# Altium schematic sheet 10-Sensing.SchDoc: Sensing (part 1 of 2)
size A2; DocumentNumber: 10; SheetNumber: 10; SheetTotal: 15
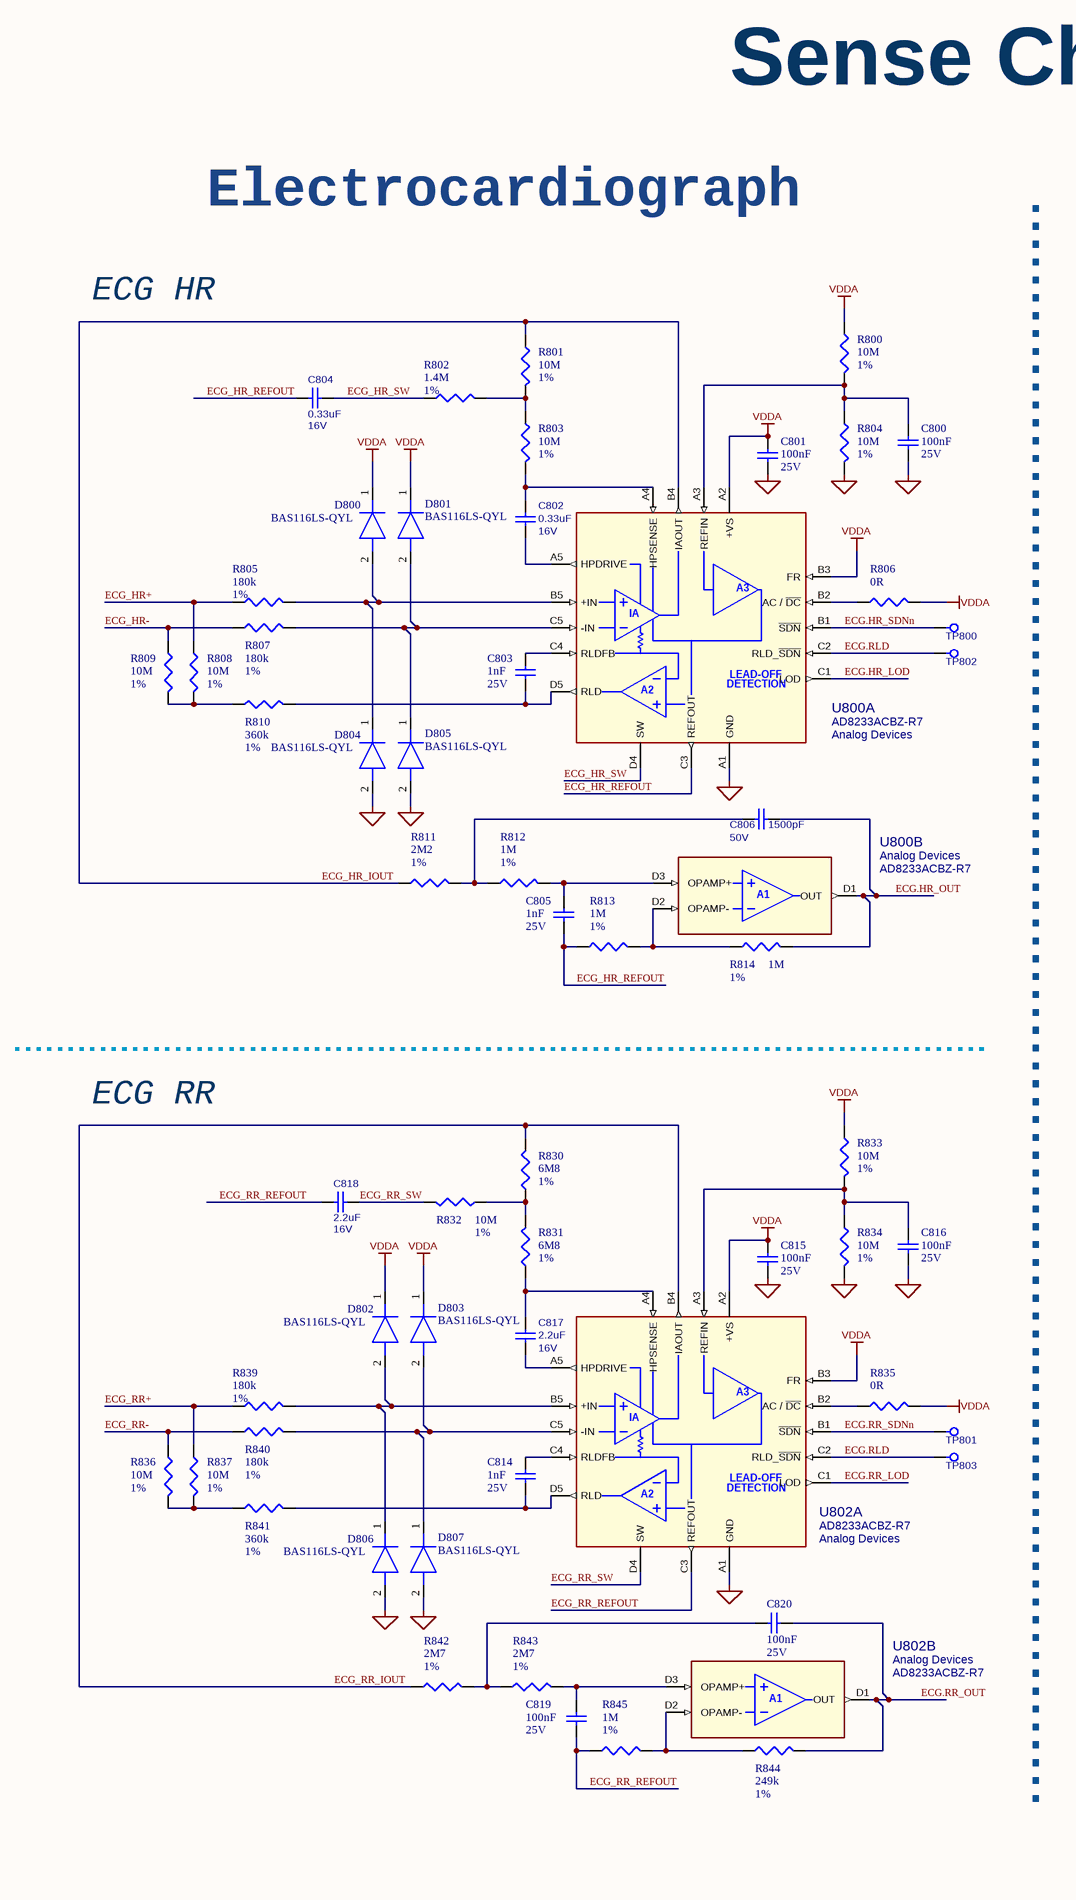
[diagram p0: 10-Sensing.SchDoc, left]
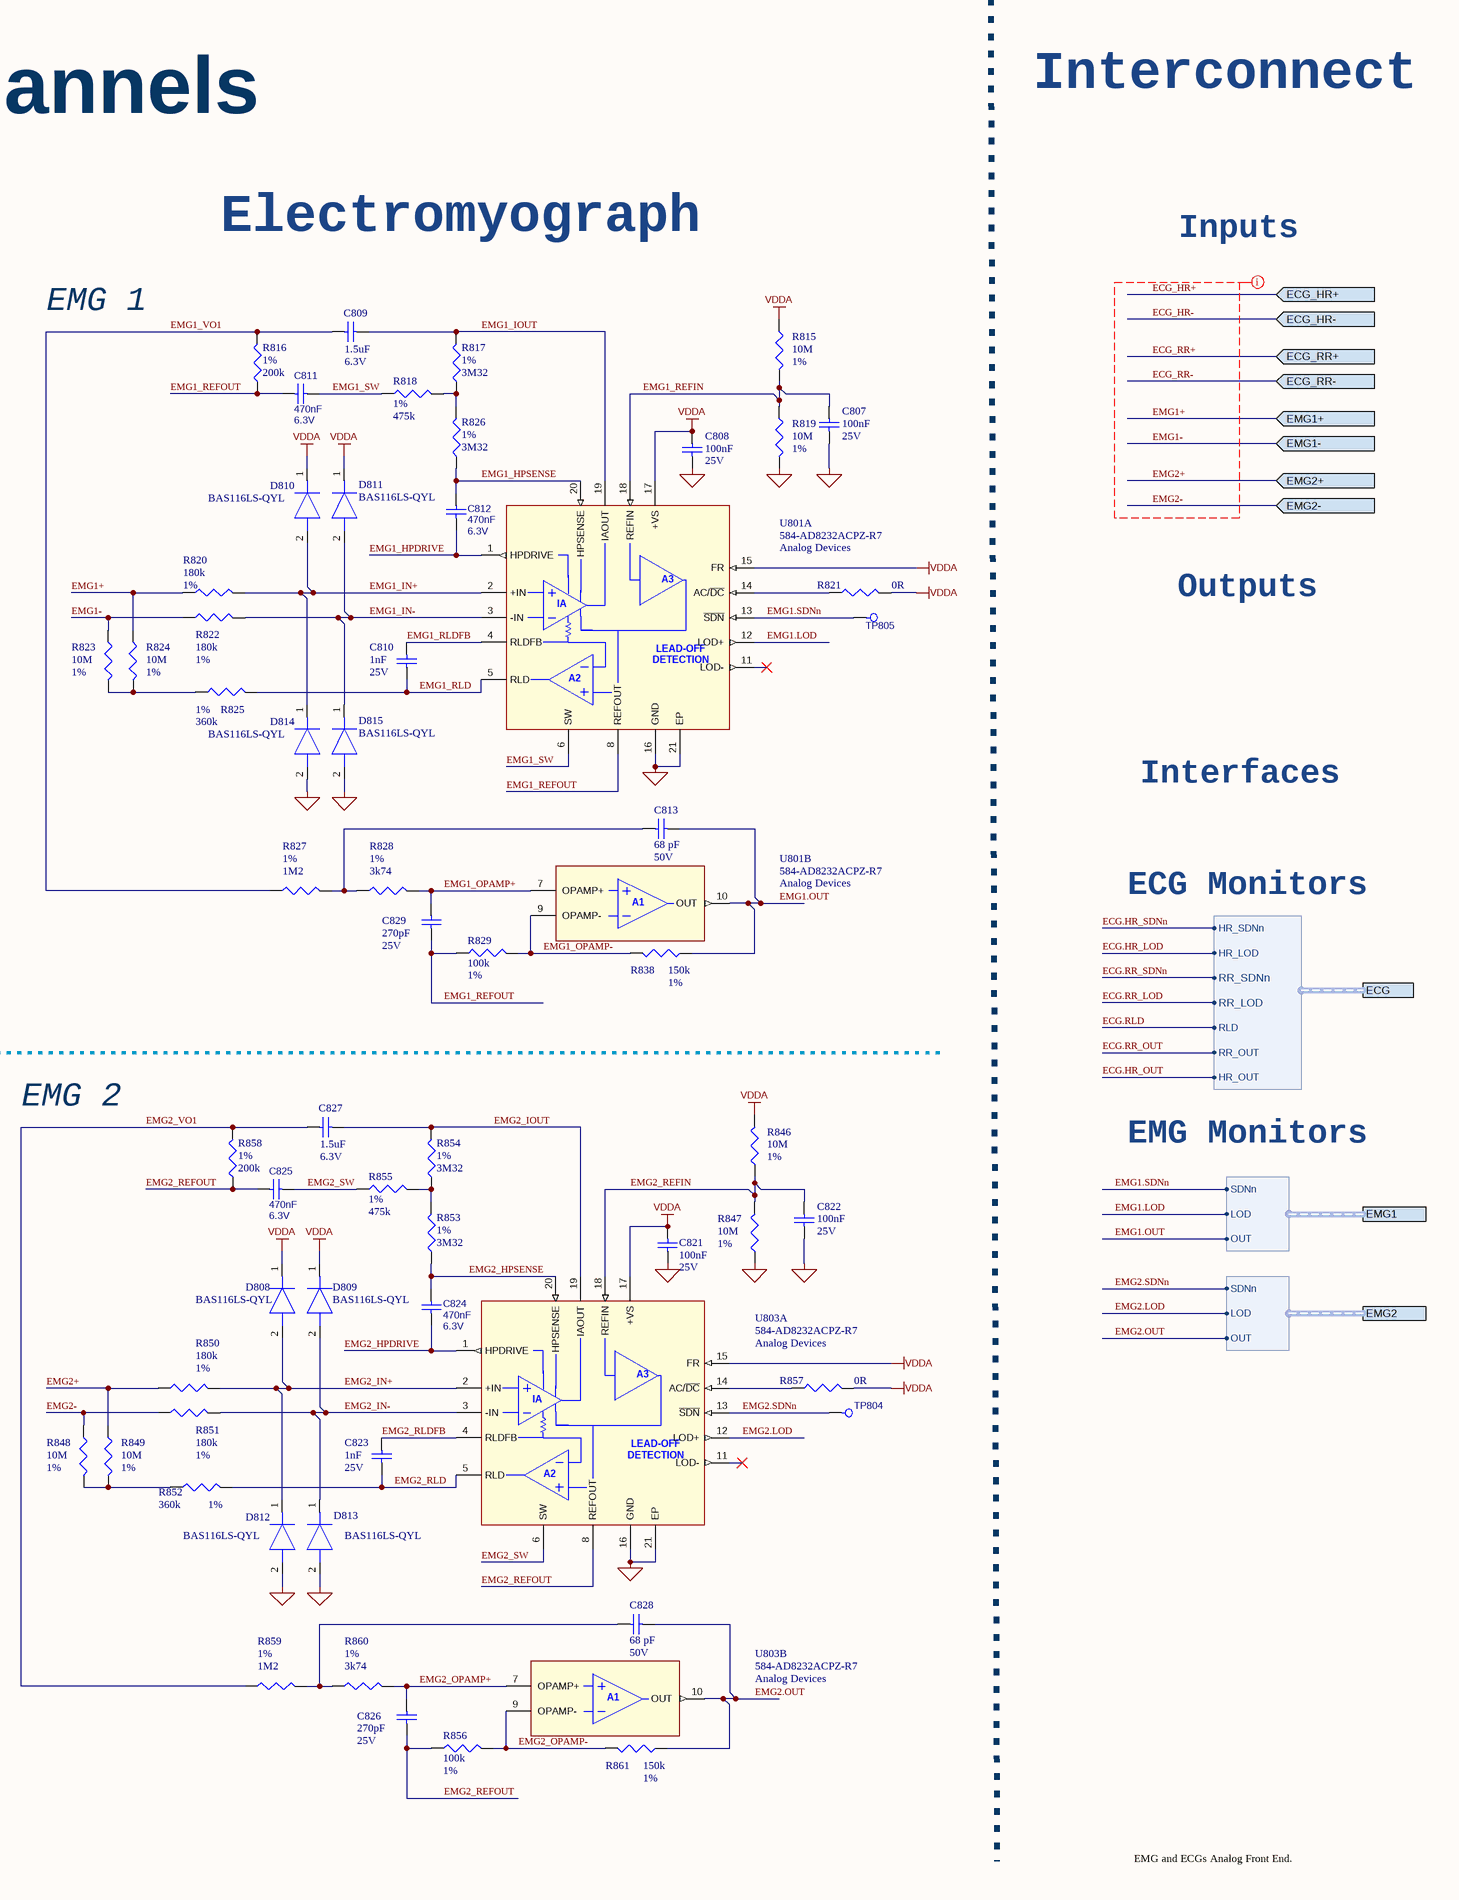
[diagram p1: 10-Sensing.SchDoc, right]

## Parts
C800  value 100nF  Rated DC Voltage (URdc): 25V  [C0201_C]  (hidden comment: GRM033R61E104KE14J)
C801  value 100nF  Rated DC Voltage (URdc): 25V  [C0201_C]  (hidden comment: GRM033R61E104KE14J)
C802  value 0.33uF  Rating: 16V  [CAP0402_REDUCED]  (hidden comment: CGA2B1X7S1C334K050BC)
C803  value 1nF  Rated DC Voltage (URdc): 25V  [C0201_C]  (hidden comment: GRM033R71E102KA01J)
C804  value 0.33uF  Rating: 16V  [CAP0402_REDUCED]  (hidden comment: CGA2B1X7S1C334K050BC)
C805  value 1nF  Rated DC Voltage (URdc): 25V  [C0201_C]  (hidden comment: GRM033R71E102KA01J)
C806  value 1500pF  Rating: 50V  [CAP0402_REDUCED]  (hidden comment: GCM155R71H152KA37D)
C807  value 100nF  Rated DC Voltage (URdc): 25V  [C0201_C]  (hidden comment: GRM033R61E104KE14J)
C808  value 100nF  Rated DC Voltage (URdc): 25V  [C0201_C]  (hidden comment: GRM033R61E104KE14J)
C809  value 1.5uF  Rated DC Voltage (URdc): 6.3V  [C0201_C]  (hidden comment: GRM033R60J155ME14D)
C810  value 1nF  Rated DC Voltage (URdc): 25V  [C0201_C]  (hidden comment: GRM033R71E102KA01J)
C811  value 470nF  Rating: 6.3V  [C0201_C]  (hidden comment: GRT033R60J474KE01D)
C812  value 470nF  Rating: 6.3V  [C0201_C]  (hidden comment: GRT033R60J474KE01D)
C813  value 68 pF  Rated DC Voltage (URdc): 50V  [C0201_C]  (hidden comment: GRM0335C1H680JA01D)
C814  value 1nF  Rated DC Voltage (URdc): 25V  [C0201_C]  (hidden comment: GRM033R71E102KA01J)
C815  value 100nF  Rated DC Voltage (URdc): 25V  [C0201_C]  (hidden comment: GRM033R61E104KE14J)
C816  value 100nF  Rated DC Voltage (URdc): 25V  [C0201_C]  (hidden comment: GRM033R61E104KE14J)
C817  value 2.2uF  Rating: 16V  [CAP0603_REDUCED]  (hidden comment: GRM188Z71C225ME43J)
C818  value 2.2uF  Rating: 16V  [CAP0603_REDUCED]  (hidden comment: GRM188Z71C225ME43J)
C819  value 100nF  Rated DC Voltage (URdc): 25V  [C0201_C]  (hidden comment: GRM033R61E104KE14J)
C820  value 100nF  Rated DC Voltage (URdc): 25V  [C0201_C]  (hidden comment: GRM033R61E104KE14J)
C821  value 100nF  Rated DC Voltage (URdc): 25V  [C0201_C]  (hidden comment: GRM033R61E104KE14J)
C822  value 100nF  Rated DC Voltage (URdc): 25V  [C0201_C]  (hidden comment: GRM033R61E104KE14J)
C823  value 1nF  Rated DC Voltage (URdc): 25V  [C0201_C]  (hidden comment: GRM033R71E102KA01J)
C824  value 470nF  Rating: 6.3V  [C0201_C]  (hidden comment: GRT033R60J474KE01D)
C825  value 470nF  Rating: 6.3V  [C0201_C]  (hidden comment: GRT033R60J474KE01D)
C826  value 270pF  Rated DC Voltage (URdc): 25V  [C0201_C]  (hidden comment: GRM0335C1E271JA01D)
C827  value 1.5uF  Rated DC Voltage (URdc): 6.3V  [C0201_C]  (hidden comment: GRM033R60J155ME14D)
C828  value 68 pF  Rated DC Voltage (URdc): 50V  [C0201_C]  (hidden comment: GRM0335C1H680JA01D)
C829  value 270pF  Rated DC Voltage (URdc): 25V  [C0201_C]  (hidden comment: GRM0335C1E271JA01D)
D800  BAS116LS-QYL  [BAS116LSQYL]
D801  BAS116LS-QYL  [BAS116LSQYL]
D802  BAS116LS-QYL  [BAS116LSQYL]
D803  BAS116LS-QYL  [BAS116LSQYL]
D804  BAS116LS-QYL  [BAS116LSQYL]
D805  BAS116LS-QYL  [BAS116LSQYL]
D806  BAS116LS-QYL  [BAS116LSQYL]
D807  BAS116LS-QYL  [BAS116LSQYL]
D808  BAS116LS-QYL  [BAS116LSQYL]
D809  BAS116LS-QYL  [BAS116LSQYL]
D810  BAS116LS-QYL  [BAS116LSQYL]
D811  BAS116LS-QYL  [BAS116LSQYL]
D812  BAS116LS-QYL  [BAS116LSQYL]
D813  BAS116LS-QYL  [BAS116LSQYL]
D814  BAS116LS-QYL  [BAS116LSQYL]
D815  BAS116LS-QYL  [BAS116LSQYL]
R800  value 10M  Tolerance: 1%  [R0201_C]  (hidden comment: CRCW020110M0FNED)
R801  value 10M  Tolerance: 1%  [R0201_C]  (hidden comment: CRCW020110M0FNED)
R802  value 1.4M  Tolerance: 1%  [R0201_C]  (hidden comment: CRCW02011M40FNED)
R803  value 10M  Tolerance: 1%  [R0201_C]  (hidden comment: CRCW020110M0FNED)
R804  value 10M  Tolerance: 1%  [R0201_C]  (hidden comment: CRCW020110M0FNED)
R805  value 180k  Tolerance: 1%  [R0201_C]  (hidden comment: CRCW0201180KFNED)
R806  value 0R  [R0201_C]  (hidden comment: CRCW02010000Z0ED)
R807  value 180k  Tolerance: 1%  [R0201_C]  (hidden comment: CRCW0201180KFNED)
R808  value 10M  Tolerance: 1%  [R0201_C]  (hidden comment: CRCW020110M0FNED)
R809  value 10M  Tolerance: 1%  [R0201_C]  (hidden comment: CRCW020110M0FNED)
R810  value 360k  Tolerance: 1%  [R0201_C]  (hidden comment: CRCW0201360KFNED)
R811  value 2M2  Tolerance: 1%  [R0201_C]  (hidden comment: CRCW02012M20FNED)
R812  value 1M  Tolerance: 1%  [R0201_C]  (hidden comment: CRCW02011M00FNED)
R813  value 1M  Tolerance: 1%  [R0201_C]  (hidden comment: CRCW02011M00FNED)
R814  value 1M  Tolerance: 1%  [R0201_C]  (hidden comment: CRCW02011M00FNED)
R815  value 10M  Tolerance: 1%  [R0201_C]  (hidden comment: CRCW020110M0FNED)
R816  value 200k  Tolerance: 1%  [R0201_C]  (hidden comment: CRCW0201200KFNED)
R817  value 3M32  Tolerance: 1%  [R0201_C]  (hidden comment: CRCW02013M32FNED)
R818  value 475k  Tolerance: 1%  [R0201_C]  (hidden comment: CRCW0201475KFNED)
R819  value 10M  Tolerance: 1%  [R0201_C]  (hidden comment: CRCW020110M0FNED)
R820  value 180k  Tolerance: 1%  [R0201_C]  (hidden comment: CRCW0201180KFNED)
R821  value 0R  [R0201_C]  (hidden comment: CRCW02010000Z0ED)
R822  value 180k  Tolerance: 1%  [R0201_C]  (hidden comment: CRCW0201180KFNED)
R823  value 10M  Tolerance: 1%  [R0201_C]  (hidden comment: CRCW020110M0FNED)
R824  value 10M  Tolerance: 1%  [R0201_C]  (hidden comment: CRCW020110M0FNED)
R825  value 360k  Tolerance: 1%  [R0201_C]  (hidden comment: CRCW0201360KFNED)
R826  value 3M32  Tolerance: 1%  [R0201_C]  (hidden comment: CRCW02013M32FNED)
R827  value 1M2  Tolerance: 1%  [R0201_C]  (hidden comment: CRCW02011M20FNED)
R828  value 3k74  Tolerance: 1%  [R0201_C]  (hidden comment: CRCW02013K74FNED)
R829  value 100k  Tolerance: 1%  [R0201_C]  (hidden comment: CRCW0201100KFNED)
R830  value 6M8  Tolerance: 1%  [R0201_C]  (hidden comment: CRCW02016M80FNED)
R831  value 6M8  Tolerance: 1%  [R0201_C]  (hidden comment: CRCW02016M80FNED)
R832  value 10M  Tolerance: 1%  [R0201_C]  (hidden comment: CRCW020110M0FNED)
R833  value 10M  Tolerance: 1%  [R0201_C]  (hidden comment: CRCW020110M0FNED)
R834  value 10M  Tolerance: 1%  [R0201_C]  (hidden comment: CRCW020110M0FNED)
R835  value 0R  [R0201_C]  (hidden comment: CRCW02010000Z0ED)
R836  value 10M  Tolerance: 1%  [R0201_C]  (hidden comment: CRCW020110M0FNED)
R837  value 10M  Tolerance: 1%  [R0201_C]  (hidden comment: CRCW020110M0FNED)
R838  value 150k  Tolerance: 1%  [R0201_C]  (hidden comment: CRCW0201150KFNED)
R839  value 180k  Tolerance: 1%  [R0201_C]  (hidden comment: CRCW0201180KFNED)
R840  value 180k  Tolerance: 1%  [R0201_C]  (hidden comment: CRCW0201180KFNED)
R841  value 360k  Tolerance: 1%  [R0201_C]  (hidden comment: CRCW0201360KFNED)
R842  value 2M7  Tolerance: 1%  [R0201_C]  (hidden comment: CRCW02012M70FNED)
R843  value 2M7  Tolerance: 1%  [R0201_C]  (hidden comment: CRCW02012M70FNED)
R844  value 249k  Tolerance: 1%  [R0201_C]  (hidden comment: CRCW0201249KFNED)
R845  value 1M  Tolerance: 1%  [R0201_C]  (hidden comment: CRCW02011M00FNED)
R846  value 10M  Tolerance: 1%  [R0201_C]  (hidden comment: CRCW020110M0FNED)
R847  value 10M  Tolerance: 1%  [R0201_C]  (hidden comment: CRCW020110M0FNED)
R848  value 10M  Tolerance: 1%  [R0201_C]  (hidden comment: CRCW020110M0FNED)
R849  value 10M  Tolerance: 1%  [R0201_C]  (hidden comment: CRCW020110M0FNED)
R850  value 180k  Tolerance: 1%  [R0201_C]  (hidden comment: CRCW0201180KFNED)
R851  value 180k  Tolerance: 1%  [R0201_C]  (hidden comment: CRCW0201180KFNED)
R852  value 360k  Tolerance: 1%  [R0201_C]  (hidden comment: CRCW0201360KFNED)
R853  value 3M32  Tolerance: 1%  [R0201_C]  (hidden comment: CRCW02013M32FNED)
R854  value 3M32  Tolerance: 1%  [R0201_C]  (hidden comment: CRCW02013M32FNED)
R855  value 475k  Tolerance: 1%  [R0201_C]  (hidden comment: CRCW0201475KFNED)
R856  value 100k  Tolerance: 1%  [R0201_C]  (hidden comment: CRCW0201100KFNED)
R857  value 0R  [R0201_C]  (hidden comment: CRCW02010000Z0ED)
R858  value 200k  Tolerance: 1%  [R0201_C]  (hidden comment: CRCW0201200KFNED)
R859  value 1M2  Tolerance: 1%  [R0201_C]  (hidden comment: CRCW02011M20FNED)
R860  value 3k74  Tolerance: 1%  [R0201_C]  (hidden comment: CRCW02013K74FNED)
R861  value 150k  Tolerance: 1%  [R0201_C]  (hidden comment: CRCW0201150KFNED)
TP800  Test Point  [testpad_0.9mm]  (value not drawn)  (no BOM)
TP801  Test Point  [testpad_0.9mm]  (value not drawn)  (no BOM)
TP802  Test Point  [testpad_0.9mm]  (value not drawn)  (no BOM)
TP803  Test Point  [testpad_0.9mm]  (value not drawn)  (no BOM)
TP804  Test Point  [testpad_0.9mm]  (value not drawn)  (no BOM)
TP805  Test Point  [testpad_0.9mm]  (value not drawn)  (no BOM)
U800  Manufacturer: Analog Devices  [AD8233ACBZ-R7]  (hidden comment: AD8233ACBZ-R7)  (parts A,B of 2)
U801  Supplier Part Number: 584-AD8232ACPZ-R7  Manufacturer: Analog Devices  [FP-CP-20-8-IPC_C]  (hidden comment: AD8232ACPZ-R7)  (parts A,B of 2)
U802  Manufacturer: Analog Devices  [AD8233ACBZ-R7]  (hidden comment: AD8233ACBZ-R7)  (parts A,B of 2)
U803  Supplier Part Number: 584-AD8232ACPZ-R7  Manufacturer: Analog Devices  [FP-CP-20-8-IPC_C]  (hidden comment: AD8232ACPZ-R7)  (parts A,B of 2)

## Ports
ECG (harness ECG), ECG_HR+ (in), ECG_HR- (in), ECG_RR+ (in), ECG_RR- (in), EMG1 (harness EMG), EMG1+ (in), EMG1- (in), EMG2 (harness EMG), EMG2+ (in), EMG2- (in)

## Harnesses
ECG: HR_SDNn, RLD, HR_LOD, HR_OUT, RR_SDNn, RR_LOD, RR_OUT
EMG: SDNn, LOD, OUT

## Nets
GND: C800.1 C801.1 C807.1 C808.1 C815.1 C816.1 C821.2 C822.2 D804.2(A) D805.2(A) D806.2(A) D807.2(A) D812.2(A) D813.2(A) D814.2(A) D815.2(A) R804.2 R819.2 R834.2 R847.1 U800.A1(GND) U801.16(GND) U801.21(EP) U802.A1(GND) U803.16(GND) U803.21(EP)
VDDA: C801.2 C808.2 C815.2 C821.1 D800.1(K) D801.1(K) D802.1(K) D803.1(K) D808.1(K) D809.1(K) D810.1(K) D811.1(K) R800.1 R806.2 R815.1 R821.2 R833.1 R835.2 R846.2 R857.2 U800.A2(+VS) U800.B3(FR) U801.15(FR) U801.17(+VS) U802.A2(+VS) U802.B3(FR) U803.15(FR) U803.17(+VS)
ECG.HR_LOD: U800.C1(LOD) ; port ECG.HR_LOD
ECG.HR_OUT: C806.1 R814.2 U800.D1(OUT) ; port ECG.HR_OUT
ECG.HR_SDNn: TP800.1 U800.B1(~{SDN}) ; port ECG.HR_SDNn
ECG.RLD: TP802.1 TP803.1 U800.C2(RLD_~{SDN}) U802.C2(RLD_~{SDN}) ; port ECG.RLD
ECG.RR_LOD: U802.C1(LOD) ; port ECG.RR_LOD
ECG.RR_OUT: C820.1 R844.2 U802.D1(OUT) ; port ECG.RR_OUT
ECG.RR_SDNn: TP801.1 U802.B1(~{SDN}) ; port ECG.RR_SDNn
ECG_HR+: R805.1 R808.1 ; port ECG_HR+
ECG_HR-: R807.1 R809.1 ; port ECG_HR-
ECG_HR_IOUT: R801.1 R811.1 U800.B4(IAOUT)
ECG_HR_REFOUT: C804.1 C805.1 R813.1 U800.C3(REFOUT)
ECG_HR_SW: C804.2 R802.1 U800.D4(SW)
ECG_RR+: R837.1 R839.1 ; port ECG_RR+
ECG_RR-: R836.1 R840.1 ; port ECG_RR-
ECG_RR_IOUT: R830.2 R842.1 U802.B4(IAOUT)
ECG_RR_REFOUT: C818.2 C819.1 R845.1 U802.C3(REFOUT)
ECG_RR_SW: C818.1 R832.2 U802.D4(SW)
EMG1+: R820.1 R824.1 ; port EMG1+
EMG1-: R822.1 R823.1 ; port EMG1-
EMG1.LOD: U801.12(LOD+) ; port EMG1.LOD
EMG1.OUT: C813.2 R838.1 U801.10(OUT) ; port EMG1.OUT
EMG1.SDNn: TP805.1 U801.13(~{SDN}) ; port EMG1.SDNn
EMG1_HPDRIVE: C812.1 U801.1(HPDRIVE)
EMG1_HPSENSE: C812.2 R826.1 U801.20(HPSENSE)
EMG1_IN+: D810.2(A) D814.1(K) R820.2 U801.2(+IN)
EMG1_IN-: D811.2(A) D815.1(K) R822.2 U801.3(-IN)
EMG1_IOUT: C809.2 R817.2 U801.19(IAOUT)
EMG1_OPAMP+: C829.2 R828.2 U801.7(OPAMP+)
EMG1_OPAMP-: R829.2 R838.2 U801.9(OPAMP-)
EMG1_REFIN: C807.2 R815.2 R819.1 U801.18(REFIN)
EMG1_REFOUT: C811.1 C829.1 R816.1 R829.1 U801.8(REFOUT)
EMG1_RLD: C810.1 R825.2 U801.5(RLD)
EMG1_RLDFB: C810.2 U801.4(RLDFB)
EMG1_SW: C811.2 R818.1 U801.6(SW)
EMG1_VO1: C809.1 R816.2 R827.1
EMG2+: R849.1 R850.1 ; port EMG2+
EMG2-: R848.1 R851.1 ; port EMG2-
EMG2.LOD: U803.12(LOD+) ; port EMG2.LOD
EMG2.OUT: C828.2 R861.1 U803.10(OUT) ; port EMG2.OUT
EMG2.SDNn: TP804.1 U803.13(~{SDN}) ; port EMG2.SDNn
EMG2_HPDRIVE: C824.1 U803.1(HPDRIVE)
EMG2_HPSENSE: C824.2 R853.1 U803.20(HPSENSE)
EMG2_IN+: D808.2(A) D812.1(K) R850.2 U803.2(+IN)
EMG2_IN-: D809.2(A) D813.1(K) R851.2 U803.3(-IN)
EMG2_IOUT: C827.2 R854.2 U803.19(IAOUT)
EMG2_OPAMP+: C826.2 R860.2 U803.7(OPAMP+)
EMG2_OPAMP-: R856.2 R861.2 U803.9(OPAMP-)
EMG2_REFIN: C822.1 R846.1 R847.2 U803.18(REFIN)
EMG2_REFOUT: C825.2 C826.1 R856.1 R858.1 U803.8(REFOUT)
EMG2_RLD: C823.1 R852.2 U803.5(RLD)
EMG2_RLDFB: C823.2 U803.4(RLDFB)
EMG2_SW: C825.1 R855.1 U803.6(SW)
EMG2_VO1: C827.1 R858.2 R859.1
NetC800_2: C800.2 R800.2 R804.1 U800.A3(REFIN)
NetC802_1: C802.1 U800.A5(HPDRIVE)
NetC802_2: C802.2 R803.2 U800.A4(HPSENSE)
NetC803_1: C803.1 R810.2 U800.D5(RLD)
NetC803_2: C803.2 U800.C4(RLDFB)
NetC805_2: C805.2 R812.2 U800.D3(OPAMP+)
NetC806_2: C806.2 R811.2 R812.1
NetC813_1: C813.1 R827.2 R828.1
NetC814_1: C814.1 R841.2 U802.D5(RLD)
NetC814_2: C814.2 U802.C4(RLDFB)
NetC816_2: C816.2 R833.2 R834.1 U802.A3(REFIN)
NetC817_1: C817.1 U802.A5(HPDRIVE)
NetC817_2: C817.2 R831.1 U802.A4(HPSENSE)
NetC819_2: C819.2 R843.2 U802.D3(OPAMP+)
NetC820_2: C820.2 R842.2 R843.1
NetC828_1: C828.1 R859.2 R860.1
NetD800_2: D800.2(A) D804.1(K) R805.2 U800.B5(+IN)
NetD801_2: D801.2(A) D805.1(K) R807.2 U800.C5(-IN)
NetD802_2: D802.2(A) D806.1(K) R839.2 U802.B5(+IN)
NetD803_2: D803.2(A) D807.1(K) R840.2 U802.C5(-IN)
NetR801_2: R801.2 R802.2 R803.1
NetR806_1: R806.1 U800.B2(AC_/_~{DC})
NetR808_2: R808.2 R809.2 R810.1
NetR813_2: R813.2 R814.1 U800.D2(OPAMP-)
NetR817_1: R817.1 R818.2 R826.2
NetR821_1: R821.1 U801.14(AC/~{DC})
NetR823_2: R823.2 R824.2 R825.1
NetR830_1: R830.1 R831.2 R832.1
NetR835_1: R835.1 U802.B2(AC_/_~{DC})
NetR836_2: R836.2 R837.2 R841.1
NetR844_1: R844.1 R845.2 U802.D2(OPAMP-)
NetR848_2: R848.2 R849.2 R852.1
NetR853_2: R853.2 R854.1 R855.2
NetR857_1: R857.1 U803.14(AC/~{DC})

Not connected (* = marked no-connect by the designer): U801 11(LOD-)*; U803 11(LOD-)*

## Layout directives
net class ANALOG: ECG_HR+, ECG_HR-, ECG_RR+, ECG_RR-, EMG1+, EMG1-, EMG2+, EMG2-

## Notes on the sheet
- Sense Channels
- Interconnect
- Electrocardiograph
- Electromyograph
- Inputs
- EMG 1
- ECG HR
- Outputs
- Interfaces
- ECG Monitors
- ECG RR
- EMG 2
- EMG Monitors
- EMG and ECGs Analog Front End.
- Project:
- Schematic:
- Design by:
- Date:
- Ver:
- .
- Comments:
- Reviewed by:
- (in symbol AD8232ACPZ-R7, part A) A3; IA; LEAD-OFF; DETECTION; A2
- (in symbol AD8232ACPZ-R7, part B) A1
- (in symbol AD8233ACBZ-R7, part A) IA; LEAD-OFF; DETECTION